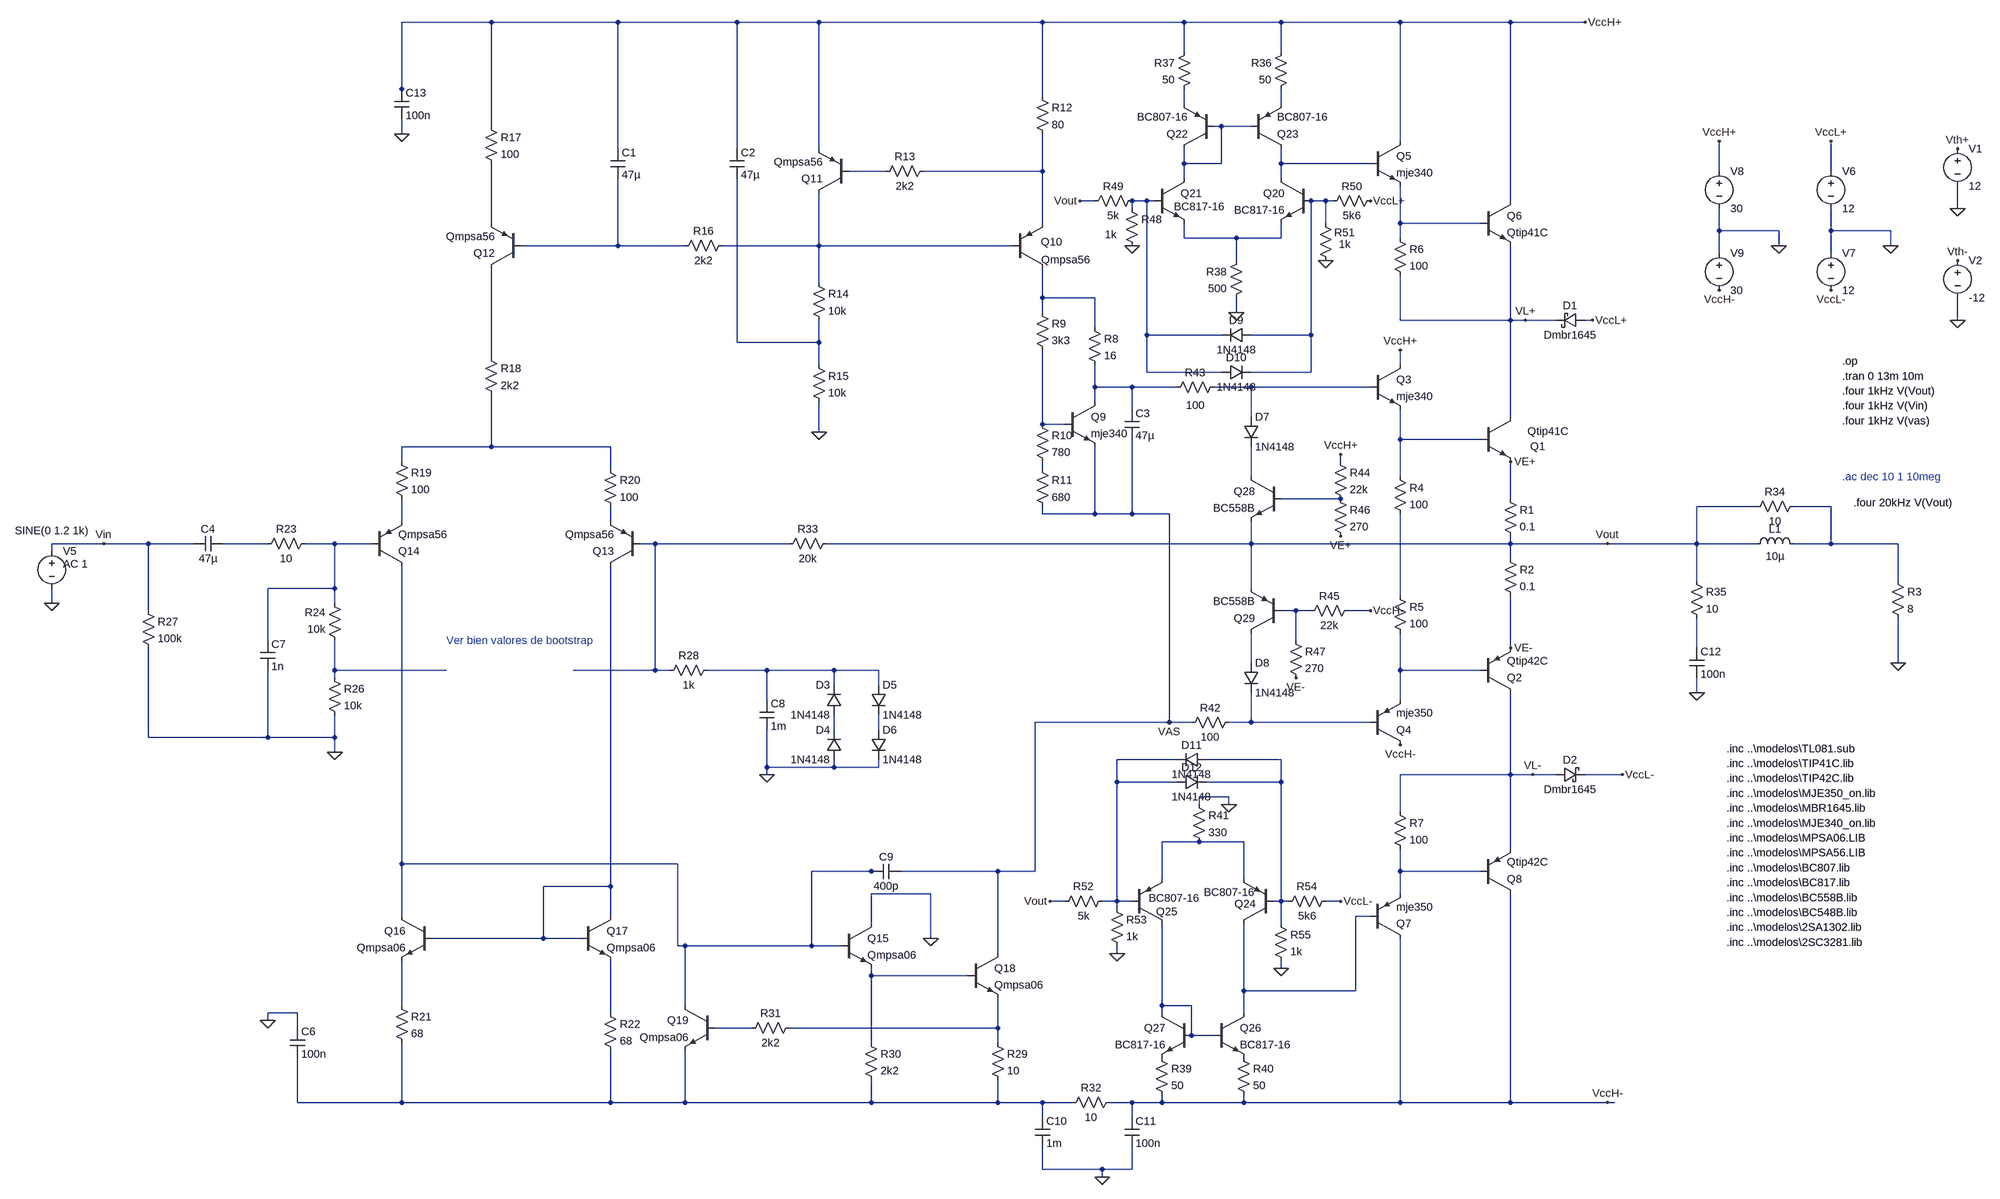
[diagram p0: schematic 3.1_circuito_completo.asc]
3.1_circuito_completo.asc, the LTspice schematic file:
Version 4
SHEET 1 1432 1652
WIRE -1984 -848 -2176 -848
WIRE -1712 -848 -1984 -848
WIRE -1456 -848 -1712 -848
WIRE -1280 -848 -1456 -848
WIRE -800 -848 -1280 -848
WIRE -496 -848 -800 -848
WIRE -288 -848 -496 -848
WIRE -32 -848 -288 -848
WIRE 240 -848 -32 -848
WIRE 400 -848 240 -848
WIRE -496 -784 -496 -848
WIRE -288 -784 -288 -848
WIRE -2176 -704 -2176 -848
WIRE -2176 -688 -2176 -704
WIRE -800 -688 -800 -848
WIRE -496 -672 -496 -704
WIRE -288 -672 -288 -704
WIRE -1984 -624 -1984 -848
WIRE -416 -624 -432 -624
WIRE -352 -624 -416 -624
WIRE -2176 -608 -2176 -640
WIRE -32 -592 -32 -848
WIRE -1712 -576 -1712 -848
WIRE -1456 -576 -1456 -848
WIRE -1280 -576 -1280 -848
WIRE -800 -544 -800 -608
WIRE -496 -544 -496 -576
WIRE -416 -544 -416 -624
WIRE -416 -544 -496 -544
WIRE -288 -544 -288 -576
WIRE -272 -544 -288 -544
WIRE -96 -544 -272 -544
WIRE -1136 -528 -1216 -528
WIRE -960 -528 -1056 -528
WIRE -800 -528 -800 -544
WIRE -800 -528 -960 -528
WIRE 688 -528 688 -592
WIRE 928 -528 928 -592
WIRE -496 -512 -496 -544
WIRE -288 -512 -288 -544
WIRE -688 -464 -720 -464
WIRE -576 -464 -608 -464
WIRE -560 -464 -576 -464
WIRE -192 -464 -224 -464
WIRE -176 -464 -192 -464
WIRE 240 -464 240 -848
WIRE -608 -448 -608 -464
WIRE -192 -448 -192 -464
WIRE 1200 -448 1200 -496
WIRE -1984 -416 -1984 -544
WIRE -800 -416 -800 -528
WIRE -192 -416 -192 -448
WIRE -32 -416 -32 -496
WIRE 64 -416 -32 -416
WIRE 176 -416 64 -416
WIRE -288 -400 -288 -416
WIRE 688 -400 688 -448
WIRE 816 -400 688 -400
WIRE 928 -400 928 -448
WIRE 1056 -400 928 -400
WIRE -496 -384 -496 -416
WIRE -384 -384 -496 -384
WIRE -288 -384 -288 -400
WIRE -288 -384 -384 -384
WIRE -32 -384 -32 -416
WIRE -1712 -368 -1712 -512
WIRE -1712 -368 -1920 -368
WIRE -1568 -368 -1712 -368
WIRE -1280 -368 -1280 -480
WIRE -1280 -368 -1488 -368
WIRE -864 -368 -1280 -368
WIRE 816 -368 816 -400
WIRE 1056 -368 1056 -400
WIRE -384 -352 -384 -384
WIRE 688 -352 688 -400
WIRE 928 -352 928 -400
WIRE -384 -336 -384 -352
WIRE -1280 -288 -1280 -368
WIRE -800 -256 -800 -320
WIRE -688 -256 -800 -256
WIRE -800 -224 -800 -256
WIRE -384 -224 -384 -256
WIRE -32 -208 -32 -304
WIRE 160 -208 -32 -208
WIRE 240 -208 240 -368
WIRE 240 -208 160 -208
WIRE 272 -208 240 -208
WIRE 336 -208 272 -208
WIRE 416 -208 400 -208
WIRE 1200 -208 1200 -256
WIRE -688 -192 -688 -256
WIRE -1984 -176 -1984 -320
WIRE -576 -176 -576 -464
WIRE -416 -176 -576 -176
WIRE -224 -176 -224 -464
WIRE -224 -176 -352 -176
WIRE -1456 -160 -1456 -512
WIRE -1280 -160 -1280 -208
WIRE -1280 -160 -1456 -160
WIRE -1984 -128 -1984 -176
WIRE -1280 -112 -1280 -160
WIRE -32 -112 -32 -144
WIRE -576 -96 -576 -176
WIRE -416 -96 -576 -96
WIRE -224 -96 -224 -176
WIRE -224 -96 -352 -96
WIRE -688 -64 -688 -112
WIRE -608 -64 -688 -64
WIRE -512 -64 -608 -64
WIRE -352 -64 -432 -64
WIRE -224 -64 -352 -64
WIRE -96 -64 -224 -64
WIRE -688 -32 -688 -64
WIRE -608 -16 -608 -64
WIRE -352 0 -352 -64
WIRE 240 0 240 -208
WIRE -800 16 -800 -144
WIRE -752 16 -800 16
WIRE -1280 32 -1280 -32
WIRE -32 48 -32 -16
WIRE 80 48 -32 48
WIRE 176 48 80 48
WIRE -1984 64 -1984 -48
WIRE -1984 64 -2176 64
WIRE -1728 64 -1984 64
WIRE -2176 80 -2176 64
WIRE -1728 80 -1728 64
WIRE -2176 96 -2176 80
WIRE -160 96 -160 80
WIRE -1728 112 -1728 80
WIRE -800 112 -800 96
WIRE -352 128 -352 64
WIRE -32 128 -32 48
WIRE 240 160 240 96
WIRE -160 176 -288 176
WIRE 240 176 240 160
WIRE 768 192 640 192
WIRE 928 192 848 192
WIRE -800 208 -800 192
WIRE -688 208 -688 64
WIRE -688 208 -800 208
WIRE -608 208 -608 48
WIRE -608 208 -688 208
WIRE -528 208 -608 208
WIRE -2176 224 -2176 176
WIRE -1728 224 -1728 192
WIRE -2816 272 -2928 272
WIRE -2720 272 -2816 272
WIRE -2624 272 -2720 272
WIRE -2464 272 -2560 272
WIRE -2320 272 -2384 272
WIRE -2240 272 -2320 272
WIRE -1632 272 -1664 272
WIRE -1344 272 -1632 272
WIRE -352 272 -352 224
WIRE -352 272 -1264 272
WIRE 240 272 240 256
WIRE 240 272 -352 272
WIRE 320 272 240 272
WIRE 448 272 320 272
WIRE 640 272 640 192
WIRE 640 272 448 272
WIRE 768 272 640 272
WIRE 928 272 928 192
WIRE 928 272 848 272
WIRE 1072 272 928 272
WIRE -2928 288 -2928 272
WIRE 240 304 240 272
WIRE 640 352 640 272
WIRE 1072 352 1072 272
WIRE -2320 368 -2320 272
WIRE -2320 368 -2464 368
WIRE -352 368 -352 272
WIRE -32 384 -32 208
WIRE -2928 400 -2928 368
WIRE -2320 400 -2320 368
WIRE -2720 416 -2720 272
WIRE -256 416 -288 416
WIRE -224 416 -256 416
WIRE -96 416 -144 416
WIRE 240 432 240 384
WIRE -2464 480 -2464 368
WIRE -256 480 -256 416
WIRE 240 496 240 432
WIRE 640 496 640 432
WIRE -352 528 -352 464
WIRE 1072 528 1072 432
WIRE -2320 544 -2320 480
WIRE -2080 544 -2320 544
WIRE -1632 544 -1632 272
WIRE -1632 544 -1808 544
WIRE -1600 544 -1632 544
WIRE -1392 544 -1520 544
WIRE -1248 544 -1392 544
WIRE -1152 544 -1248 544
WIRE -32 544 -32 464
WIRE 80 544 -32 544
WIRE 176 544 80 544
WIRE -2320 560 -2320 544
WIRE -1248 576 -1248 544
WIRE -1152 576 -1152 544
WIRE 640 592 640 560
WIRE -1392 608 -1392 544
WIRE -32 608 -32 544
WIRE -528 656 -528 208
WIRE -528 656 -816 656
WIRE -480 656 -528 656
WIRE -352 656 -352 592
WIRE -352 656 -400 656
WIRE -96 656 -352 656
WIRE -1248 672 -1248 640
WIRE -1152 672 -1152 640
WIRE -2720 688 -2720 496
WIRE -2464 688 -2464 544
WIRE -2464 688 -2720 688
WIRE -2320 688 -2320 640
WIRE -2320 688 -2464 688
WIRE -2320 720 -2320 688
WIRE -512 736 -640 736
WIRE -288 736 -448 736
WIRE -1392 752 -1392 672
WIRE -1248 752 -1248 736
WIRE -1248 752 -1392 752
WIRE -1152 752 -1152 736
WIRE -1152 752 -1248 752
WIRE -1392 768 -1392 752
WIRE 64 768 -32 768
WIRE 240 768 240 592
WIRE 240 768 64 768
WIRE 288 768 240 768
WIRE 336 768 288 768
WIRE 480 768 400 768
WIRE -640 784 -640 736
WIRE -512 784 -640 784
WIRE -288 784 -288 736
WIRE -288 784 -448 784
WIRE -400 816 -464 816
WIRE -464 832 -464 816
WIRE -400 832 -400 816
WIRE -32 848 -32 768
WIRE -464 912 -544 912
WIRE -368 912 -464 912
WIRE -368 928 -368 912
WIRE 240 928 240 768
WIRE -2176 960 -2176 320
WIRE -1584 960 -2176 960
WIRE -1168 976 -1296 976
WIRE -1152 976 -1168 976
WIRE -896 976 -1104 976
WIRE -816 976 -816 656
WIRE -816 976 -896 976
WIRE -32 976 -32 928
WIRE 48 976 -32 976
WIRE 176 976 48 976
WIRE -544 992 -544 912
WIRE -368 992 -368 928
WIRE -1728 1008 -1728 320
WIRE -1728 1008 -1872 1008
WIRE -1040 1024 -1168 1024
WIRE -32 1024 -32 976
WIRE -752 1040 -784 1040
WIRE -640 1040 -640 784
WIRE -640 1040 -672 1040
WIRE -608 1040 -640 1040
WIRE -288 1040 -288 784
WIRE -288 1040 -304 1040
WIRE -272 1040 -288 1040
WIRE -160 1040 -192 1040
WIRE -640 1056 -640 1040
WIRE -2176 1072 -2176 960
WIRE -1728 1072 -1728 1008
WIRE -96 1072 -128 1072
WIRE -1168 1088 -1168 1024
WIRE -288 1088 -288 1040
WIRE -1872 1120 -1872 1008
WIRE -1872 1120 -2112 1120
WIRE -1792 1120 -1872 1120
WIRE -1040 1120 -1040 1024
WIRE -896 1120 -896 976
WIRE -1584 1136 -1584 960
WIRE -1568 1136 -1584 1136
WIRE -1296 1136 -1296 976
WIRE -1296 1136 -1568 1136
WIRE -1232 1136 -1296 1136
WIRE -896 1152 -896 1120
WIRE -640 1152 -640 1136
WIRE -288 1184 -288 1168
WIRE -1168 1200 -1168 1184
WIRE -960 1200 -1168 1200
WIRE -368 1232 -368 1088
WIRE -128 1232 -128 1072
WIRE -128 1232 -368 1232
WIRE -2176 1264 -2176 1168
WIRE -1568 1264 -1568 1136
WIRE -544 1264 -544 1088
WIRE -480 1264 -544 1264
WIRE -2400 1280 -2464 1280
WIRE -1728 1280 -1728 1168
WIRE -544 1280 -544 1264
WIRE -368 1280 -368 1232
WIRE -2464 1296 -2464 1280
WIRE -2400 1312 -2400 1280
WIRE -1424 1312 -1504 1312
WIRE -896 1312 -896 1248
WIRE -896 1312 -1344 1312
WIRE -480 1328 -480 1264
WIRE -432 1328 -480 1328
WIRE -1168 1344 -1168 1200
WIRE -896 1344 -896 1312
WIRE -2400 1472 -2400 1376
WIRE -2176 1472 -2176 1344
WIRE -2176 1472 -2400 1472
WIRE -1728 1472 -1728 1360
WIRE -1728 1472 -2176 1472
WIRE -1568 1472 -1568 1360
WIRE -1568 1472 -1728 1472
WIRE -1168 1472 -1168 1424
WIRE -1168 1472 -1568 1472
WIRE -896 1472 -896 1424
WIRE -896 1472 -1168 1472
WIRE -800 1472 -896 1472
WIRE -736 1472 -800 1472
WIRE -608 1472 -656 1472
WIRE -544 1472 -544 1456
WIRE -544 1472 -608 1472
WIRE -368 1472 -368 1456
WIRE -368 1472 -544 1472
WIRE -32 1472 -32 1120
WIRE -32 1472 -368 1472
WIRE 240 1472 240 1024
WIRE 240 1472 -32 1472
WIRE 448 1472 240 1472
WIRE 464 1472 448 1472
WIRE -800 1504 -800 1472
WIRE -608 1504 -608 1472
WIRE -800 1616 -800 1568
WIRE -672 1616 -800 1616
WIRE -608 1616 -608 1568
WIRE -608 1616 -672 1616
WIRE -672 1632 -672 1616
FLAG 1072 528 0
FLAG -2928 400 0
FLAG 448 272 Vout
FLAG -2816 272 Vin
FLAG 816 -368 0
FLAG 688 -592 VccH+
FLAG 688 -272 VccH-
FLAG 400 -848 VccH+
FLAG 448 1472 VccH-
FLAG 1056 -368 0
FLAG 928 -592 VccL+
FLAG 928 -272 VccL-
FLAG 416 -208 VccL+
FLAG 480 768 VccL-
FLAG 1200 -448 0
FLAG 1200 -576 Vth+
FLAG 1200 -208 0
FLAG 1200 -336 Vth-
FLAG -1280 32 0
FLAG -2320 720 0
FLAG -2464 1296 0
FLAG -1392 768 0
FLAG -1040 1120 0
FLAG -672 1632 0
FLAG -528 656 VAS
FLAG 640 592 0
FLAG -2176 -608 0
FLAG -32 -144 VccH+
FLAG -32 704 VccH-
FLAG -160 80 VccH+
FLAG -96 416 VccH-
FLAG 240 96 VE+
FLAG 240 496 VE-
FLAG -160 256 VE+
FLAG -256 560 VE-
FLAG -96 -464 VccL+
FLAG -720 -464 Vout
FLAG -608 -368 0
FLAG -192 -336 0
FLAG -384 -224 0
FLAG -160 1040 VccL-
FLAG -784 1040 Vout
FLAG -640 1152 0
FLAG -288 1184 0
FLAG -400 832 0
FLAG 272 -208 VL+
FLAG 288 768 VL-
DATAFLAG 320 272 ""
DATAFLAG 240 160 "round(Ie(Q1)*10k)/10k"
DATAFLAG 240 432 "round(Ie(Q2)*10k)/10k"
DATAFLAG 80 48 ""
DATAFLAG 80 544 ""
DATAFLAG 64 768 ""
DATAFLAG 160 -208 ""
DATAFLAG -896 976 ""
DATAFLAG -960 -528 ""
DATAFLAG -800 -544 "I(R12)"
DATAFLAG -384 -384 ""
DATAFLAG -288 -400 "round(10k*Ie(Q12))/10k"
DATAFLAG -272 -544 ""
DATAFLAG -576 -464 ""
DATAFLAG -192 -448 ""
DATAFLAG -384 -352 "round(I(R19)*10k)/10k"
DATAFLAG -464 912 ""
DATAFLAG -368 928 "Ie(Q16)"
DATAFLAG 64 -416 ""
DATAFLAG -224 -64 ""
DATAFLAG 48 976 ""
DATAFLAG -896 1120 "Ic(Q18)"
DATAFLAG -2176 80 "Ie(Q14)"
DATAFLAG -1728 80 "Ie(Q13)"
DATAFLAG -1984 -176 "I(R18)"
SYMBOL npn 176 0 R0
WINDOW 3 100 31 Left 2
WINDOW 0 106 63 Left 2
SYMATTR Value Qtip41C
SYMATTR InstName Q1
SYMBOL npn -96 -112 R0
SYMATTR InstName Q3
SYMATTR Value mje340
SYMBOL pnp 176 592 M180
SYMATTR InstName Q2
SYMATTR Value Qtip42C
SYMBOL res 224 160 R0
SYMATTR InstName R1
SYMATTR Value 0.1
SYMBOL res 224 288 R0
SYMATTR InstName R2
SYMATTR Value 0.1
SYMBOL res 1056 336 R0
SYMATTR InstName R3
SYMATTR Value 8
SYMBOL pnp -96 704 M180
SYMATTR InstName Q4
SYMATTR Value mje350
SYMBOL res -48 112 R0
SYMATTR InstName R4
SYMATTR Value 100
SYMBOL res -48 368 R0
SYMATTR InstName R5
SYMATTR Value 100
SYMBOL voltage -2928 272 R0
WINDOW 3 -79 -28 Left 2
WINDOW 123 24 44 Left 2
WINDOW 39 0 0 Left 2
SYMATTR Value SINE(0 1.2 1k)
SYMATTR Value2 AC 1
SYMATTR InstName V5
SYMBOL res -48 -400 R0
SYMATTR InstName R6
SYMATTR Value 100
SYMBOL npn -96 -592 R0
SYMATTR InstName Q5
SYMATTR Value mje340
SYMBOL npn 176 -464 R0
SYMATTR InstName Q6
SYMATTR Value Qtip41C
SYMBOL schottky 400 -224 R90
WINDOW 0 0 32 VBottom 2
WINDOW 3 32 32 VTop 2
SYMATTR InstName D1
SYMATTR Value Dmbr1645
SYMBOL schottky 336 784 R270
WINDOW 0 32 32 VTop 2
WINDOW 3 0 32 VBottom 2
SYMATTR InstName D2
SYMATTR Value Dmbr1645
SYMBOL pnp 176 1024 M180
SYMATTR InstName Q8
SYMATTR Value Qtip42C
SYMBOL pnp -96 1120 M180
SYMATTR InstName Q7
SYMATTR Value mje350
SYMBOL res -48 832 R0
SYMATTR InstName R7
SYMATTR Value 100
SYMBOL voltage 688 -544 R0
WINDOW 123 0 0 Left 2
WINDOW 39 0 0 Left 2
SYMATTR InstName V8
SYMATTR Value 30
SYMBOL voltage 688 -368 R0
WINDOW 123 0 0 Left 2
WINDOW 39 0 0 Left 2
SYMATTR InstName V9
SYMATTR Value 30
SYMBOL voltage 928 -544 R0
WINDOW 123 0 0 Left 2
WINDOW 39 0 0 Left 2
SYMATTR InstName V6
SYMATTR Value 12
SYMBOL voltage 928 -368 R0
WINDOW 123 0 0 Left 2
WINDOW 39 0 0 Left 2
SYMATTR InstName V7
SYMATTR Value 12
SYMBOL voltage 1200 -592 R0
WINDOW 123 0 0 Left 2
WINDOW 39 0 0 Left 2
SYMATTR InstName V1
SYMATTR Value 12
SYMBOL voltage 1200 -352 R0
WINDOW 123 0 0 Left 2
WINDOW 39 0 0 Left 2
SYMATTR InstName V2
SYMATTR Value -12
SYMBOL npn -752 -32 R0
SYMATTR InstName Q9
SYMATTR Value mje340
SYMBOL res -704 -208 R0
SYMATTR InstName R8
SYMATTR Value 16
SYMBOL res -816 -240 R0
SYMATTR InstName R9
SYMATTR Value 3k3
SYMBOL res -816 0 R0
SYMATTR InstName R10
SYMATTR Value 780
SYMBOL res -816 96 R0
SYMATTR InstName R11
SYMATTR Value 680
SYMBOL pnp -864 -320 M180
WINDOW 0 60 56 Left 2
WINDOW 3 61 18 Left 2
SYMATTR InstName Q10
SYMATTR Value Qmpsa56
SYMBOL res -816 -704 R0
SYMATTR InstName R12
SYMATTR Value 80
SYMBOL res -1040 -544 R90
WINDOW 0 0 56 VBottom 2
WINDOW 3 32 56 VTop 2
SYMATTR InstName R13
SYMATTR Value 2k2
SYMBOL pnp -1216 -480 R180
SYMATTR InstName Q11
SYMATTR Value Qmpsa56
SYMBOL res -1296 -304 R0
SYMATTR InstName R14
SYMATTR Value 10k
SYMBOL res -1296 -128 R0
SYMATTR InstName R15
SYMATTR Value 10k
SYMBOL res -1472 -384 R90
WINDOW 0 0 56 VBottom 2
WINDOW 3 32 56 VTop 2
SYMATTR InstName R16
SYMATTR Value 2k2
SYMBOL cap -1728 -576 R0
SYMATTR InstName C1
SYMATTR Value 47µ
SYMBOL cap -1472 -576 R0
SYMATTR InstName C2
SYMATTR Value 47µ
SYMBOL cap -624 -16 R0
SYMATTR InstName C3
SYMATTR Value 47µ
SYMBOL res -2000 -640 R0
SYMATTR InstName R17
SYMATTR Value 100
SYMBOL pnp -1920 -320 R180
SYMATTR InstName Q12
SYMATTR Value Qmpsa56
SYMBOL res -2000 -144 R0
SYMATTR InstName R18
SYMATTR Value 2k2
SYMBOL res -2192 80 R0
SYMATTR InstName R19
SYMATTR Value 100
SYMBOL res -1744 96 R0
SYMATTR InstName R20
SYMATTR Value 100
SYMBOL pnp -1664 320 R180
SYMATTR InstName Q13
SYMATTR Value Qmpsa56
SYMBOL pnp -2240 320 M180
SYMATTR InstName Q14
SYMATTR Value Qmpsa56
SYMBOL res -2192 1248 R0
SYMATTR InstName R21
SYMATTR Value 68
SYMBOL res -1744 1264 R0
SYMATTR InstName R22
SYMATTR Value 68
SYMBOL cap -2560 256 R90
WINDOW 0 0 32 VBottom 2
WINDOW 3 32 32 VTop 2
SYMATTR InstName C4
SYMATTR Value 47µ
SYMBOL res -2368 256 R90
WINDOW 0 0 56 VBottom 2
WINDOW 3 32 56 VTop 2
SYMATTR InstName R23
SYMATTR Value 10
SYMBOL res -2304 496 R180
WINDOW 0 36 76 Left 2
WINDOW 3 36 40 Left 2
SYMATTR InstName R24
SYMATTR Value 10k
SYMBOL cap -2416 1312 R0
SYMATTR InstName C6
SYMATTR Value 100n
SYMBOL res -1504 528 R90
WINDOW 0 0 56 VBottom 2
WINDOW 3 32 56 VTop 2
SYMATTR InstName R28
SYMATTR Value 1k
SYMBOL cap -1408 608 R0
SYMATTR InstName C8
SYMATTR Value 1m
SYMBOL diode -1232 640 R180
WINDOW 0 24 64 Left 2
WINDOW 3 24 0 Left 2
SYMATTR InstName D3
SYMATTR Value 1N4148
SYMBOL diode -1232 736 R180
WINDOW 0 24 64 Left 2
WINDOW 3 24 0 Left 2
SYMATTR InstName D4
SYMATTR Value 1N4148
SYMBOL diode -1168 576 R0
SYMATTR InstName D5
SYMATTR Value 1N4148
SYMBOL diode -1168 672 R0
SYMATTR InstName D6
SYMATTR Value 1N4148
SYMBOL npn -1792 1072 R0
SYMATTR InstName Q17
SYMATTR Value Qmpsa06
SYMBOL npn -2112 1072 M0
SYMATTR InstName Q16
SYMATTR Value Qmpsa06
SYMBOL npn -1232 1088 R0
SYMATTR InstName Q15
SYMATTR Value Qmpsa06
SYMBOL npn -960 1152 R0
SYMATTR InstName Q18
SYMATTR Value Qmpsa06
SYMBOL res -912 1328 R0
SYMATTR InstName R29
SYMATTR Value 10
SYMBOL cap -1104 960 R90
WINDOW 0 0 32 VBottom 2
WINDOW 3 32 32 VTop 2
SYMATTR InstName C9
SYMATTR Value 400p
SYMBOL res -1184 1328 R0
SYMATTR InstName R30
SYMATTR Value 2k2
SYMBOL res -1328 1296 R90
WINDOW 0 0 56 VBottom 2
WINDOW 3 32 56 VTop 2
SYMATTR InstName R31
SYMATTR Value 2k2
SYMBOL npn -1504 1264 M0
SYMATTR InstName Q19
SYMATTR Value Qmpsa06
SYMBOL res -640 1456 R90
WINDOW 0 0 56 VBottom 2
WINDOW 3 32 56 VTop 2
SYMATTR InstName R32
SYMATTR Value 10
SYMBOL cap -816 1504 R0
SYMATTR InstName C10
SYMATTR Value 1m
SYMBOL cap -624 1504 R0
SYMATTR InstName C11
SYMATTR Value 100n
SYMBOL res -1248 256 R90
WINDOW 0 0 56 VBottom 2
WINDOW 3 32 56 VTop 2
SYMATTR InstName R33
SYMATTR Value 20k
SYMBOL ind 752 288 R270
WINDOW 0 32 56 VTop 2
WINDOW 3 5 56 VBottom 2
SYMATTR InstName L1
SYMATTR Value 10µ
SYMBOL res 864 176 R90
WINDOW 0 0 56 VBottom 2
WINDOW 3 32 56 VTop 2
SYMATTR InstName R34
SYMATTR Value 10
SYMBOL res 624 336 R0
SYMATTR InstName R35
SYMATTR Value 10
SYMBOL cap 624 496 R0
SYMATTR InstName C12
SYMATTR Value 100n
SYMBOL cap -2192 -704 R0
SYMATTR InstName C13
SYMATTR Value 100n
SYMBOL npn -288 128 M0
SYMATTR InstName Q28
SYMATTR Value BC558B
SYMBOL pnp -288 464 R180
SYMATTR InstName Q29
SYMATTR Value BC558B
SYMBOL diode -368 0 R0
SYMATTR InstName D7
SYMATTR Value 1N4148
SYMBOL diode -368 528 R0
SYMATTR InstName D8
SYMATTR Value 1N4148
SYMBOL res -384 640 R90
WINDOW 0 0 56 VBottom 2
WINDOW 3 32 56 VTop 2
SYMATTR InstName R42
SYMATTR Value 100
SYMBOL res -416 -80 R90
WINDOW 0 0 56 VBottom 2
WINDOW 3 39 56 VTop 2
SYMATTR InstName R43
SYMATTR Value 100
SYMBOL res -176 80 R0
SYMATTR InstName R44
SYMATTR Value 22k
SYMBOL res -128 400 R90
WINDOW 0 0 56 VBottom 2
WINDOW 3 32 56 VTop 2
SYMATTR InstName R45
SYMATTR Value 22k
SYMBOL res -176 160 R0
SYMATTR InstName R46
SYMATTR Value 270
SYMBOL res -272 464 R0
SYMATTR InstName R47
SYMATTR Value 270
SYMBOL res -272 -800 M0
SYMATTR InstName R36
SYMATTR Value 50
SYMBOL res -480 -800 M0
SYMATTR InstName R37
SYMATTR Value 50
SYMBOL npn -224 -512 M0
SYMATTR InstName Q20
SYMATTR Value BC817-16
SYMBOL npn -560 -512 R0
WINDOW 3 42 60 Left 2
SYMATTR Value BC817-16
SYMATTR InstName Q21
SYMBOL res -368 -352 M0
SYMATTR InstName R38
SYMATTR Value 500
SYMBOL pnp -432 -576 R180
SYMATTR InstName Q22
SYMATTR Value BC807-16
SYMBOL pnp -352 -576 M180
SYMATTR InstName Q23
SYMATTR Value BC807-16
SYMBOL res -624 -464 R0
WINDOW 3 -42 72 Left 2
SYMATTR InstName R48
SYMATTR Value 1k
SYMBOL res -592 -480 R90
WINDOW 0 0 56 VBottom 2
WINDOW 3 32 56 VTop 2
SYMATTR InstName R49
SYMATTR Value 5k
SYMBOL res -80 -480 R90
WINDOW 0 0 56 VBottom 2
WINDOW 3 32 56 VTop 2
SYMATTR InstName R50
SYMATTR Value 5k6
SYMBOL res -176 -320 R180
WINDOW 0 -47 76 Left 2
WINDOW 3 -38 51 Left 2
SYMATTR InstName R51
SYMATTR Value 1k
SYMBOL pnp -304 1088 R180
WINDOW 0 38 42 Left 2
WINDOW 3 41 67 Left 2
SYMATTR InstName Q24
SYMATTR Value BC807-16
SYMBOL pnp -608 1088 M180
WINDOW 0 52 26 Left 2
WINDOW 3 36 55 Left 2
SYMATTR InstName Q25
SYMATTR Value BC807-16
SYMBOL res -560 1360 R0
SYMATTR InstName R39
SYMATTR Value 50
SYMBOL res -384 1360 R0
SYMATTR InstName R40
SYMATTR Value 50
SYMBOL res -480 816 R0
SYMATTR InstName R41
SYMATTR Value 330
SYMBOL npn -432 1280 R0
SYMATTR InstName Q26
SYMATTR Value BC817-16
SYMBOL npn -480 1280 M0
SYMATTR InstName Q27
SYMATTR Value BC817-16
SYMBOL res -656 1024 R90
WINDOW 0 0 56 VBottom 2
WINDOW 3 32 56 VTop 2
SYMATTR InstName R52
SYMATTR Value 5k
SYMBOL res -656 1040 R0
SYMATTR InstName R53
SYMATTR Value 1k
SYMBOL res -176 1024 R90
WINDOW 0 0 56 VBottom 2
WINDOW 3 32 56 VTop 2
SYMATTR InstName R54
SYMATTR Value 5k6
SYMBOL res -304 1072 R0
SYMATTR InstName R55
SYMATTR Value 1k
SYMBOL diode -352 -192 R90
WINDOW 0 0 32 VBottom 2
WINDOW 3 32 32 VTop 2
SYMATTR InstName D9
SYMATTR Value 1N4148
SYMBOL diode -416 -80 R270
WINDOW 0 32 32 VTop 2
WINDOW 3 0 32 VBottom 2
SYMATTR InstName D10
SYMATTR Value 1N4148
SYMBOL diode -448 720 R90
WINDOW 0 0 32 VBottom 2
WINDOW 3 32 32 VTop 2
SYMATTR InstName D11
SYMATTR Value 1N4148
SYMBOL diode -512 800 R270
WINDOW 0 32 32 VTop 2
WINDOW 3 0 32 VBottom 2
SYMATTR InstName D12
SYMATTR Value 1N4148
SYMBOL res -2336 544 R0
SYMATTR InstName R26
SYMATTR Value 10k
SYMBOL cap -2480 480 R0
SYMATTR InstName C7
SYMATTR Value 1n
SYMBOL res -2736 400 R0
SYMATTR InstName R27
SYMATTR Value 100k
TEXT 952 -88 Left 2 !.tran 0 13m 10m
TEXT 952 -24 Left 2 !.four 1kHz V(Vin)
TEXT 952 -56 Left 2 !.four 1kHz V(Vout)
TEXT 952 -120 Left 2 !.op
TEXT 952 8 Left 2 !.four 1kHz V(vas)
TEXT 952 128 Left 2 ;.ac dec 10 1 10meg
TEXT 976 184 Left 2 !.four 20kHz V(Vout)
TEXT 704 1032 Left 2 !.inc ..\\modelos\\BC558B.lib
TEXT 704 1064 Left 2 !.inc ..\\modelos\\BC548B.lib
TEXT 704 968 Left 2 !.inc ..\\modelos\\BC807.lib
TEXT 704 1000 Left 2 !.inc ..\\modelos\\BC817.lib
TEXT 704 1096 Left 2 !.inc ..\\modelos\\2SA1302.lib
TEXT 704 1128 Left 2 !.inc ..\\modelos\\2SC3281.lib
TEXT 704 904 Left 2 !.inc ..\\modelos\\MPSA06.LIB
TEXT 704 936 Left 2 !.inc ..\\modelos\\MPSA56.LIB
TEXT 704 712 Left 2 !.inc ..\\modelos\\TL081.sub
TEXT 704 744 Left 2 !.inc ..\\modelos\\TIP41C.lib
TEXT 704 776 Left 2 !.inc ..\\modelos\\TIP42C.lib
TEXT 704 872 Left 2 !.inc ..\\modelos\\MJE340_on.lib
TEXT 704 808 Left 2 !.inc ..\\modelos\\MJE350_on.lib
TEXT 704 840 Left 2 !.inc ..\\modelos\\MBR1645.lib
TEXT -2080 480 Left 2 ;Ver bien valores de bootstrap

The netlist it stands for:
* 3.1_circuito_completo.asc
Q1 VL+ N020 VE+ 0 Qtip41C
Q3 VccH+ N018 N020 0 mje340
Q2 VL- N037 VE- 0 Qtip42C
R1 VE+ Vout 0.1
R2 Vout VE- 0.1
R3 N025 0 8
Q4 VccH- N038 N037 0 mje350
R4 N020 N031 100
R5 N031 N037 100
V5 Vin 0 SINE(0 1.2 1k) AC 1
R6 N010 VL+ 100
Q5 VccH+ N005 N010 0 mje340
Q6 VccH+ N010 VL+ 0 Qtip41C
D1 VccL+ VL+ Dmbr1645
D2 VL- VccL- Dmbr1645
Q8 VccH- N045 VL- 0 Qtip42C
Q7 VccH- N047 N045 0 mje350
R7 VL- N045 100
V8 VccH+ 0 30
V9 0 VccH- 30
V6 VccL+ 0 12
V7 0 VccL- 12
V1 Vth+ 0 12
V2 Vth- 0 -12
Q9 N017 N019 VAS 0 mje340
R8 N014 N017 16
R9 N014 N019 3k3
R10 N019 N022 780
R11 N022 VAS 680
Q10 N014 N013 N004 0 Qmpsa56
R12 VccH+ N004 80
R13 N004 N006 2k2
Q11 N013 N006 VccH+ 0 Qmpsa56
R14 N013 N016 10k
R15 N016 0 10k
R16 N013 N012 2k2
C1 VccH+ N012 47µ
C2 VccH+ N016 47µ
C3 N017 VAS 47µ
R17 VccH+ N009 100
Q12 N015 N012 N009 0 Qmpsa56
R18 N015 N021 2k2
R19 N021 N026 100
R20 N021 N027 100
Q13 N046 N030 N027 0 Qmpsa56
Q14 N044 N029 N026 0 Qmpsa56
R21 N049 N054 68
R22 N051 N054 68
C4 N028 Vin 47µ
R23 N029 N028 10
R24 N035 N029 10k
C6 0 N054 100n
R28 N036 N030 1k
C8 N036 0 1m
D3 N039 N036 1N4148
D4 0 N039 1N4148
D5 N036 N040 1N4148
D6 N040 0 1N4148
Q17 N046 N046 N051 0 Qmpsa06
Q16 N044 N046 N049 0 Qmpsa06
Q15 0 N044 N048 0 Qmpsa06
Q18 VAS N048 N053 0 Qmpsa06
R29 N053 N054 10
C9 VAS N044 400p
R30 N048 N054 2k2
R31 N053 N052 2k2
Q19 N044 N052 N054 0 Qmpsa06
R32 VccH- N054 10
C10 N054 0 1m
C11 VccH- 0 100n
R33 Vout N030 20k
L1 Vout N025 10µ
R34 N025 Vout 10
R35 Vout N033 10
C12 N033 0 100n
C13 VccH+ 0 100n
Q28 N023 N024 Vout 0 BC558B
Q29 N034 N032 Vout 0 BC558B
D7 N018 N023 1N4148
D8 N034 N038 1N4148
R42 N038 VAS 100
R43 N018 N017 100
R44 VccH+ N024 22k
R45 VccH- N032 22k
R46 N024 VE+ 270
R47 N032 VE- 270
R36 VccH+ N002 50
R37 VccH+ N001 50
Q20 N005 N008 N011 0 BC817-16
Q21 N003 N007 N011 0 BC817-16
R38 N011 0 500
Q22 N003 N003 N001 0 BC807-16
Q23 N005 N003 N002 0 BC807-16
R48 N007 0 1k
R49 N007 Vout 5k
R50 VccL+ N008 5k6
R51 0 N008 1k
Q24 N047 N042 N043 0 BC807-16
Q25 N050 N041 N043 0 BC807-16
R39 P001 VccH- 50
R40 P002 VccH- 50
R41 0 N043 330
Q26 N047 N050 P002 0 BC817-16
Q27 N050 N050 P001 0 BC817-16
R52 N041 Vout 5k
R53 N041 0 1k
R54 VccL- N042 5k6
R55 N042 0 1k
D9 N008 N007 1N4148
D10 N007 N008 1N4148
D11 N042 N041 1N4148
D12 N041 N042 1N4148
R26 N035 0 10k
C7 N029 0 1n
R27 Vin 0 100k
.model D D
.lib standard.dio
.model NPN NPN
.model PNP PNP
.lib standard.bjt
.tran 0 13m 10m
.four 1kHz V(Vin)
.four 1kHz V(Vout)
.op
.four 1kHz V(vas)
* .ac dec 10 1 10meg
.four 20kHz V(Vout)
.inc ..\modelos\BC558B.lib
.inc ..\modelos\BC548B.lib
.inc ..\modelos\BC807.lib
.inc ..\modelos\BC817.lib
.inc ..\modelos\2SA1302.lib
.inc ..\modelos\2SC3281.lib
.inc ..\modelos\MPSA06.LIB
.inc ..\modelos\MPSA56.LIB
.inc ..\modelos\TL081.sub
.inc ..\modelos\TIP41C.lib
.inc ..\modelos\TIP42C.lib
.inc ..\modelos\MJE340_on.lib
.inc ..\modelos\MJE350_on.lib
.inc ..\modelos\MBR1645.lib
* Ver bien valores de bootstrap
.backanno
.end